# EAGLE design OLED (EAGLE 7.2.0)
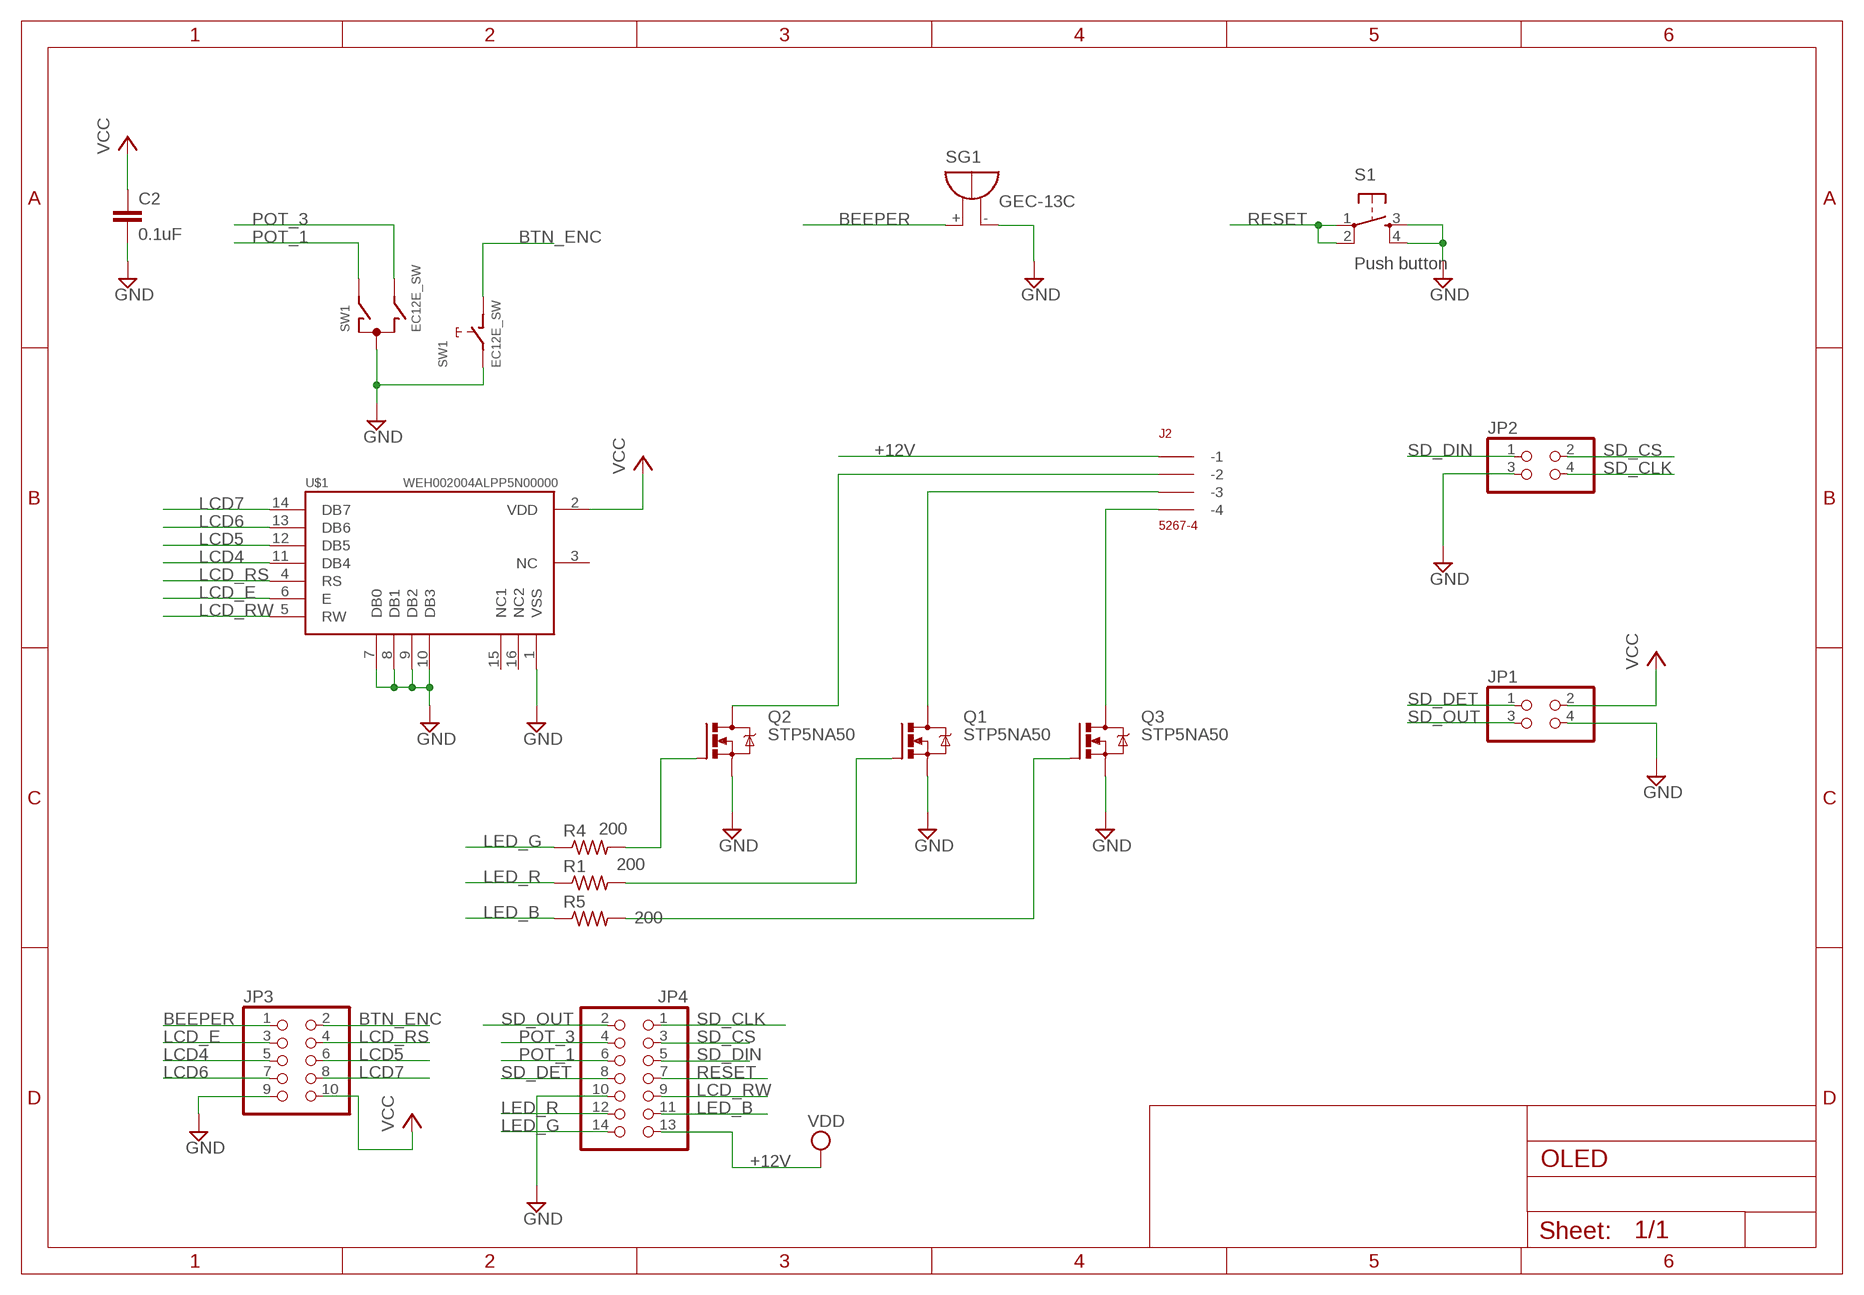
[diagram p0: schematic, sheet 1]

## Parts
C2  0.1uF  C-EUC0805  [C0805]
J2  5267-4  [5267-4]
JP1  PINHD-2X2  [2X02]
JP2  PINHD-2X2  [2X02]
JP3  PINHD-2X5/90  [2X05/90]
JP4  PINHD-2X7/90  [2X07/90]
Q1  STP5NA50  [TO220BV]
Q2  STP5NA50  [TO220BV]
Q3  STP5NA50  [TO220BV]
R1  200  R-US_R2012  [R2012]
R4  200  R-US_R2012  [R2012]
R5  200  R-US_R2012  [R2012]
S1  Push button  TAC_SWITCHPTH  [TACTILE-PTH]
SG1  GEC-13C  F/TMB  [F/TMB]
SW1  EC12E_SW  [ALPS_EC12E_SW]
U$1  OLED  [WEH002004ALPP5N00000]

## Nets
+12V: J2.P$1(-1) JP4.13 ; supply symbol labelled VDD
BEEPER: JP3.1 SG1.+
BTN_ENC: JP3.2 SW1.D
GND: C2.2 JP1.4 JP2.3 JP3.9 JP4.10 Q1.S Q2.S Q3.S S1.3 S1.4 SG1.- SW1.C SW1.E U$1.1(VSS) U$1.7(DB0) U$1.8(DB1) U$1.9(DB2) U$1.10(DB3)
LCD4: JP3.5 U$1.11(DB4)
LCD5: JP3.6 U$1.12(DB5)
LCD6: JP3.7 U$1.13(DB6)
LCD7: JP3.8 U$1.14(DB7)
LCD_E: JP3.3 U$1.6(E)
LCD_RS: JP3.4 U$1.4(RS)
LCD_RW: JP4.9 U$1.5(RW)
LED_B: JP4.11 R5.1
LED_G: JP4.14 R4.1
LED_R: JP4.12 R1.1
N$4: Q2.G R4.2
N$5: Q1.G R1.2
N$6: Q3.G R5.2
N$7: J2.P$2(-2) Q2.D
N$8: J2.P$3(-3) Q1.D
N$9: J2.P$4(-4) Q3.D
POT_1: JP4.6 SW1.A
POT_3: JP4.4 SW1.B
RESET: JP4.7 S1.1 S1.2
SD_CLK: JP2.4 JP4.1
SD_CS: JP2.2 JP4.3
SD_DET: JP1.1 JP4.8
SD_DIN: JP2.1 JP4.5
SD_OUT: JP1.3 JP4.2
VCC: C2.1 JP1.2 JP3.10 U$1.2(VDD)
Unconnected: SW1.GND1(G) SW1.GND2(G) U$1.3(NC) U$1.15(NC1) U$1.16(NC2)

## Library data of the parts
C2 = rcl:C-EU: CAPACITOR, European symbol
J2 = con-molex-spox:5267-4
JP1 JP2 = pinhead:PINHD-2X2: PIN HEADER
JP3 = pinhead:PINHD-2X5: PIN HEADER
JP4 = pinhead:PINHD-2X7: PIN HEADER
Q1-Q3 = transistor-power:STP5NA50: N-CHANNEL MOS FET
R1 R4 R5 = rcl:R-US_: RESISTOR, American symbol
S1 = SparkFun:TAC_SWITCH: Momentary Switch Button commonly used for reset or general input. Spark Fun Electronics SKU : COM-00097
SG1 = buzzer:F/TMB: BUZZER Source: Buerklin; OC_FARNELL: unknown; OC_NEWARK: unknown
SW1 = switch-alps:EC12E_SW: ALPS rotary Encoder EC12E series with switch; MPN: EC12E2424407; OC_FARNELL: 1520813; OC_NEWARK: 74M1068
U$1 = OLED:OLED

## Board
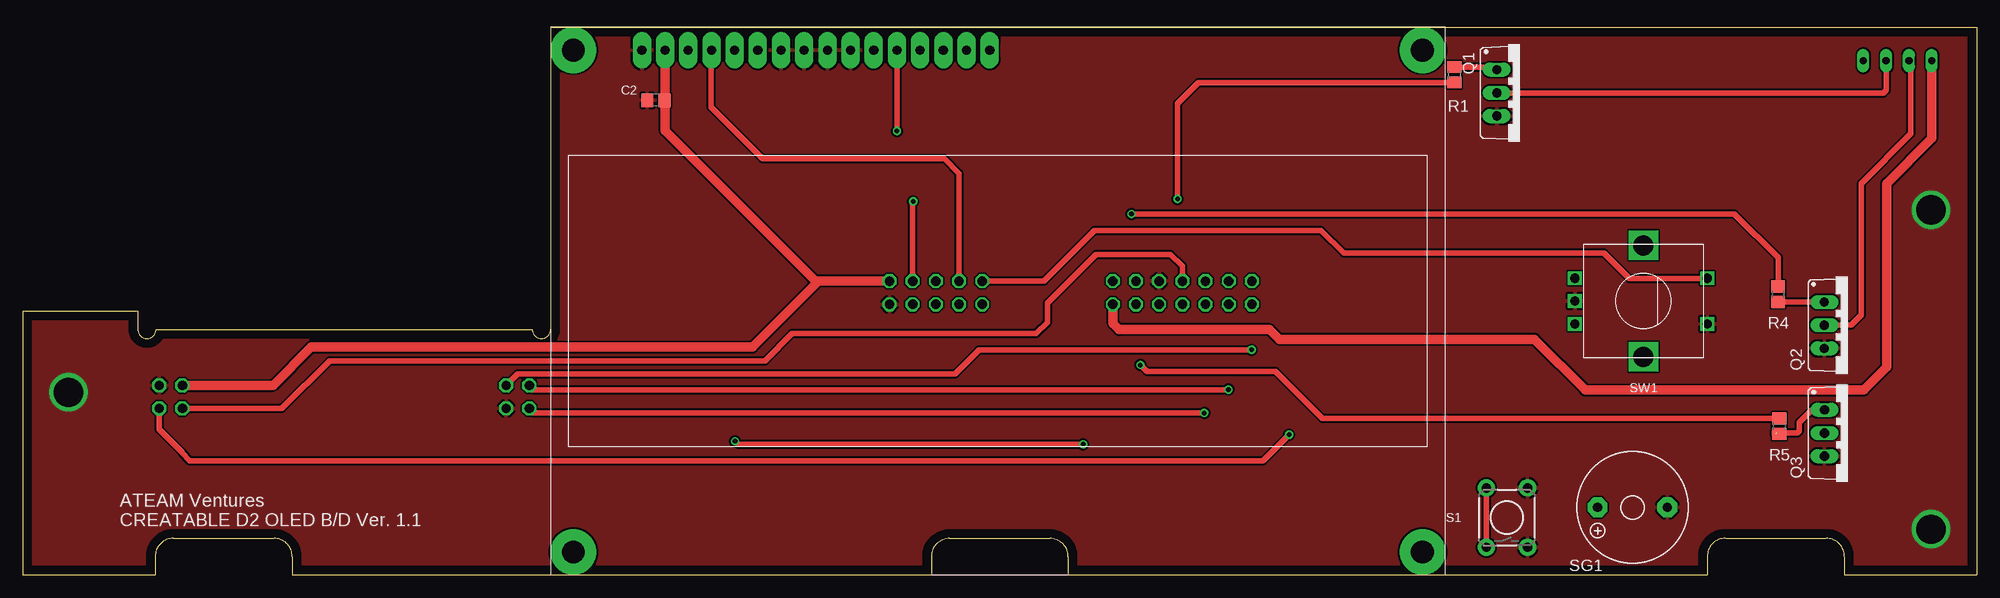
[diagram p1: board, top side]
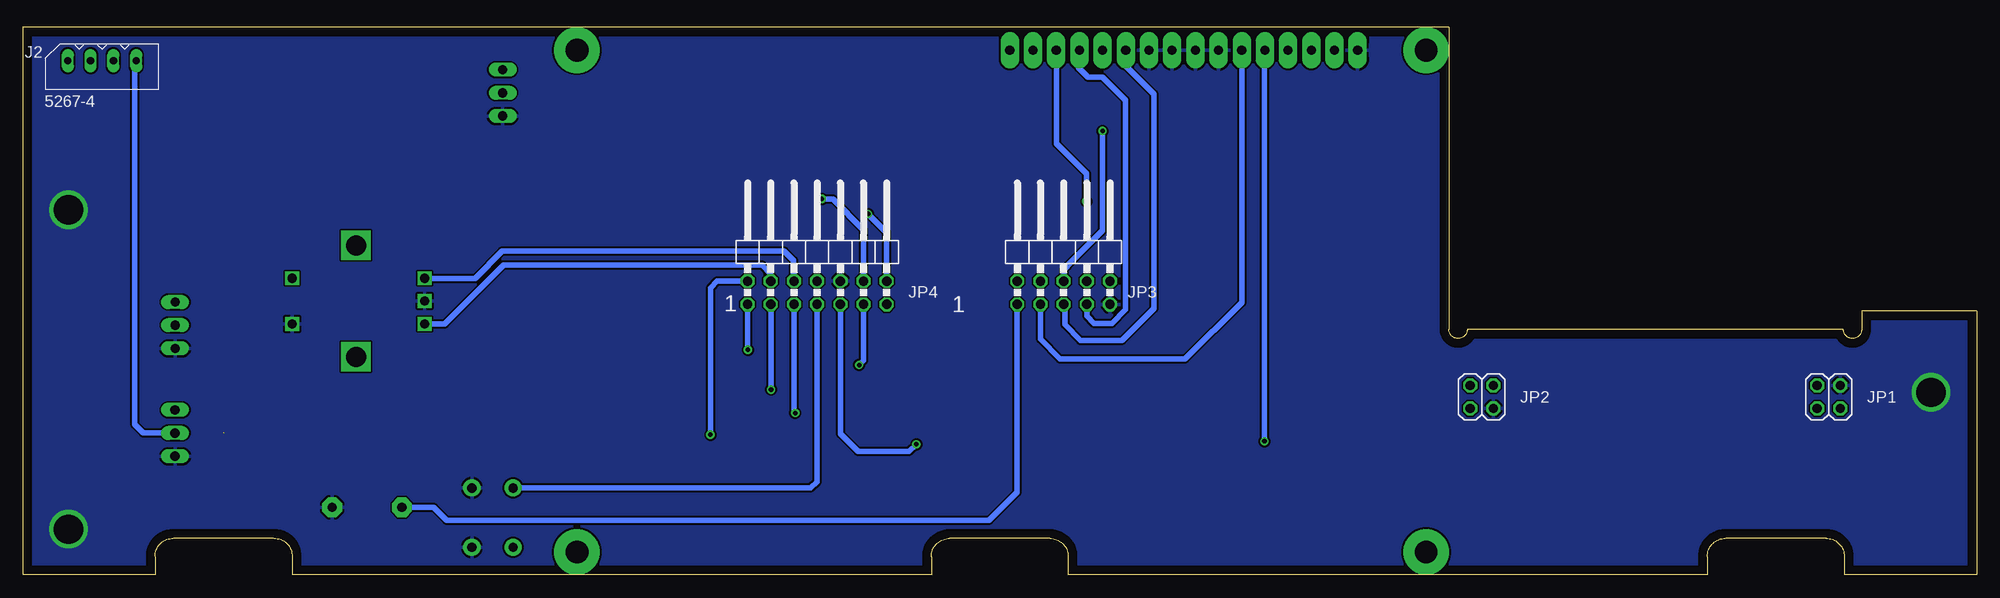
[diagram p2: board, bottom side, seen from below]

Size 214 x 60 mm. Coordinates in mm from the lower left corner, seen from the top.
Outline: 29.5,2 29.5,0 99.5,0 99.5,2 arc-90 101.5,4 112.5,4 arc-90 114.5,2 114.5,0 184.5,0 184.5,2
Outline: 14.5,2 14.5,0 0,0 0,28.9 12.6,28.9 12.6,26.9 arc180 14.6,26.9 55.8,26.9 arc180 57.8,26.9 57.8,60 214,60 214,0 199.5,0 199.5,2
Outline: 16.5,4.01 arc90 14.5,2.01
Outline: 16.49,4 27.49,4
Outline: 29.5,2 arc90 27.5,4
Outline: 186.5,4.01 197.5,4.01
Outline: 199.51,2.01 arc90 197.51,4.01
Outline: 186.49,4.01 arc90 184.49,2.01
Copper layers (1*16): Top 0.035mm / dielectric 1.5mm / Bottom 0.035mm
Design rules "default *": minimum track width 10mil, minimum drill 0.3mm, track to track 8mil, track to pad 8mil, pad to pad 8mil, via to via 8mil, smd to smd 8mil, copper to edge 40mil, drill to drill 8mil, minimum pad ring 10mil, minimum via ring 8mil, stop-mask expansion 4mil, vias tented up to drill 0mil, thermal gap 10mil

### Footprints (pad centres in the part's own frame; a part is rotated, then mirrored left to right if it is on the bottom)
C0805 = smd 1.3 x 1.5: 1 -0.95,0; 2 0.95,0
5267-4 = drill 0.8 long: P$1 0,0; P$2 2.5,0; P$3 5,0; P$4 7.5,0
2X02 = drill 1.016 octagon: 1 -1.27,-1.27; 2 -1.27,1.27; 3 1.27,-1.27; 4 1.27,1.27
2X05/90 = drill 1.016 octagon: 1 -5.08,-6.35; 2 -5.08,-3.81; 3 -2.54,-6.35; 4 -2.54,-3.81; 5 0,-6.35; 6 0,-3.81; 7 2.54,-6.35; 8 2.54,-3.81; 9 5.08,-6.35; 10 5.08,-3.81
2X07/90 = drill 1.016 octagon: 1 -7.62,-6.35; 2 -7.62,-3.81; 3 -5.08,-6.35; 4 -5.08,-3.81; 5 -2.54,-6.35; 6 -2.54,-3.81; 7 0,-6.35; 8 0,-3.81; 9 2.54,-6.35; 10 2.54,-3.81; 11 5.08,-6.35; 12 5.08,-3.81; 13 7.62,-6.35; 14 7.62,-3.81
TO220BV = drill 1.016 long: D 0,-2.54; G -2.54,-2.54; S 2.54,-2.54
R2012 = smd 1.3 x 1.5: 1 -0.85,0; 2 0.85,0
TACTILE-PTH = drill 1.016 pad 1.88: 1 -3.251,2.261; 2 3.251,2.261; 3 -3.251,-2.261; 4 3.251,-2.261
F/TMB = drill 1.016 pad 2.159 octagon: + 3.81,0; - -3.81,0
ALPS_EC12E_SW = drill 1 square: A -2.5,-7.5; B 2.5,-7.5; C 0,-7.5; D -2.5,7; E 2.5,7 | drill 2.2 square: GND1 -6.1,0; GND2 6.1,0
WEH002004ALPP5N00000 = drill 1 pad 2 long: 1 -39,27.5; 2 -36.46,27.5; 3 -33.92,27.5; 4 -31.38,27.5; 5 -28.84,27.5; 6 -26.3,27.5; 7 -23.76,27.5; 8 -21.22,27.5; 9 -18.68,27.5; 10 -16.14,27.5; 11 -13.6,27.5; 12 -11.06,27.5; 13 -8.52,27.5; 14 -5.98,27.5; 15 -3.44,27.5; 16 -0.9,27.5 | drill 2.5 pad 5: P$17 -46.5,27.5; P$18 -46.5,-27.5; P$19 46.5,-27.5; P$20 46.5,27.5

### Placement (x,y rotation side)
C2  69.35,52 180 top
J2  209.08,56.35 0 bottom
JP1  16.2,19.5 0 bottom
JP2  54.2,19.5 0 bottom
JP3  100,36 0 bottom
JP4  127,36 0 bottom
Q1  163.98,52.83 270 top
Q2  199.86,27.36 270 top
Q3  199.87,15.54 270 top
R1  156.79,54.81 90 top
R4  192.25,30.76 270 top
R5  192.38,16.3 270 top
S1  162.55,6.27 90 top
SG1  176.3,7.39 180 top
SW1  177.5,30 270 top
U$1  106.8,30 0 top

### Tracks (layer width: path | path; a pad name or v marks a point on that pad's centre or on a via)
+12V
  Top 1.016: J2.P$1 209.08,47.84 204.13,42.9 204.13,22.77 201.61,20.24 171.12,20.24 165.56,25.8 137.64,25.8 136.56,26.88 120.08,26.88 119.41,27.55 119.41,29.62 JP4.13
BEEPER
  Bottom 0.61: JP3.1 105.09,29.64 105.09,9.05 108.17,5.98 167.6,5.98 169.01,7.39 SG1.+
BTN_ENC
  Top 0.61: SW1.D 184.46,32.46 175.98,32.46 173.16,35.28 144.67,35.28 142.2,37.75 117.38,37.75 112.33,32.7 111.82,32.19 JP3.2
GND  (via drill 3.2)
  other vias: 5,20 209,40 209,5
  pour Top: -1.3,29.67 13.73,29.67 13.73,28.08 56.53,28.08 56.53,61.22 215.42,61.22 215.42,-1.3 -1.3,-1.3
  pour Bottom: -2.02,30.39 14.02,30.39 14.02,28.65 55.95,28.65 55.95,61.8 216,61.8 216,-2.03 -2.02,-2.03
LCD4
  Bottom 0.61: JP3.5 99.87,29.52 99.87,27.41 98.14,25.68 93.62,25.68 90.11,29.19 90.11,52.65 93.2,55.74 U$1.11
LCD5  (via drill 0.5)
  Top 0.61: U$1.12 v95.74,48.64
  Bottom 0.61: v95.74,48.64 95.74,37.75 95.94,37.55 99.59,33.9 99.59,33.86 99.99,33.46 JP3.6
LCD6
  Bottom 0.61: JP3.7 97.46,28.38 96.66,27.57 94.73,27.57 93.24,29.07 93.24,52.02 95.76,54.55 97.32,54.55 98.36,55.58 98.36,57.42 U$1.13
LCD7  (via drill 0.5)
  Top 0.61: JP3.8 97.46,40.86
  Top 0.813: 97.46,40.86 v97.52,40.92
  Bottom 0.61: v97.52,40.92 97.52,43.98 100.79,47.26 100.79,57.47
  Bottom 0.813: 100.79,57.47 U$1.14
LCD_E
  Bottom 0.61: U$1.6 80.5,29.87 86.7,23.67 100.38,23.67 102.54,25.83 JP3.3
LCD_RS
  Top 0.61: JP3.4 102.54,43.99 100.92,45.61 81.04,45.61 75.41,51.24 75.41,57.49 U$1.4
LCD_RW  (via drill 0.5)
  Top 0.61: v116.14,14.31 78.34,14.31 v78.01,14.64
  Bottom 0.61: JP4.9 124.46,15.44 122.54,13.52 116.93,13.52 v116.14,14.31 | v78.01,14.64 78.01,57.45 U$1.5
LED_B  (via drill 0.5)
  Top 0.61: v122.4,23 123.11,22.29 137.18,22.29 142.32,17.15 R5.1
  Bottom 0.61: v122.4,23 122.4,23.04 121.92,23.52 JP4.11
LED_G  (via drill 0.5)
  Top 0.61: v121.43,39.55 187.47,39.55 192.26,34.75 192.26,31.62 R4.1
  Bottom 0.61: JP4.14 119.38,37.53 120.7,38.85 120.73,38.85 v121.43,39.55
LED_R  (via drill 0.5)
  Top 0.61: R1.1 128.79,53.96 126.46,51.63 v126.46,41.21 v126.47,41.2
  Bottom 0.61: JP4.12 121.92,37.8 125.28,41.16 126.43,41.16 v126.47,41.2
N$4
  Top 0.61: Q2.G R4.2
N$5
  Top 0.61: R1.2 161.15,55.66 Q1.G
N$6  (1 unrouted)
  Top 0.61: 192.03,15.48 191.85,15.67 | Q3.G 195.92,18.08 194.58,16.74 194.58,15.78 194.37,15.57 192.42,15.57 | 192.42,15.57 192.01,15.57 191.84,15.4 | R5.2 192.38,15.53 192.42,15.57
N$7
  Top 0.61: Q2.D 200.25,27.36 201.34,28.46 201.34,42.9 206.79,48.34 206.79,56.13 J2.P$2
N$8
  Top 0.61: J2.P$3 204.08,53.12 203.76,52.8 161.47,52.8 Q1.D
N$9
  Bottom 0.61: Q3.D 200.79,15.54 201.73,16.48 201.73,56.2 J2.P$4
POT_1
  Bottom 0.61: SW1.A 164.46,32.5 161.48,35.48 135.18,35.48 135.17,35.49 130.63,35.49 129.57,34.43 129.57,32.22 JP4.6
POT_3
  Bottom 0.61: JP4.4 132.08,32.99 133.05,33.96 161.33,33.96 167.79,27.5 SW1.B
RESET
  Top 0.61: S1.1 S1.2
  Bottom 0.61: JP4.7 127,10.22 127.7,9.52 S1.2
SD_CLK  (via drill 0.5)
  Top 0.61: v134.58,24.66 104.73,24.66 102.11,22.04 54.2,22.04 JP2.4 52.96,20.3
  Bottom 0.61: JP4.1 134.62,24.7 v134.58,24.66
SD_CS  (via drill 0.5)
  Top 0.61: v132.05,20.3 132.02,20.27 55.97,20.27 JP2.2
  Bottom 0.61: v132.05,20.3 132.05,29.62 JP4.3
SD_DET
  Top 0.61: JP4.8 127,33.83 125.7,35.13 117.55,35.13 112.22,29.8 112.22,27.67 110.99,26.44 84.25,26.44 81.28,23.47 33.6,23.47 28.36,18.23 JP1.1
SD_DIN  (via drill 0.5)
  Top 0.61: v129.4,17.74 55.96,17.74 JP2.1
  Bottom 0.61: JP4.5 129.54,17.88 v129.4,17.74
SD_OUT  (via drill 0.5)
  Top 0.61: v138.69,15.36 135.84,12.51 18.3,12.51 17.45,13.36 17.45,13.41 14.93,15.93 JP1.3
  Bottom 0.61: v138.69,15.36 138.69,31.44 137.94,32.19 JP4.2
VCC
  Top 0.61: 70.34,52.04 C2.1
  Top 1.016: 70.34,52.04 U$1.2 | JP3.10 87.15,32.19 | 87.15,32.19 86.85,32.19 70.37,48.67 70.37,51.93 C2.1 | 87.15,32.19 79.91,24.95 31.58,24.95 27.4,20.77 JP1.2

### Text on the board
tNames: ATEAM Ventures / CREATABLE D2 OLED B/D Ver. 1.1
bNames: 1 | 1